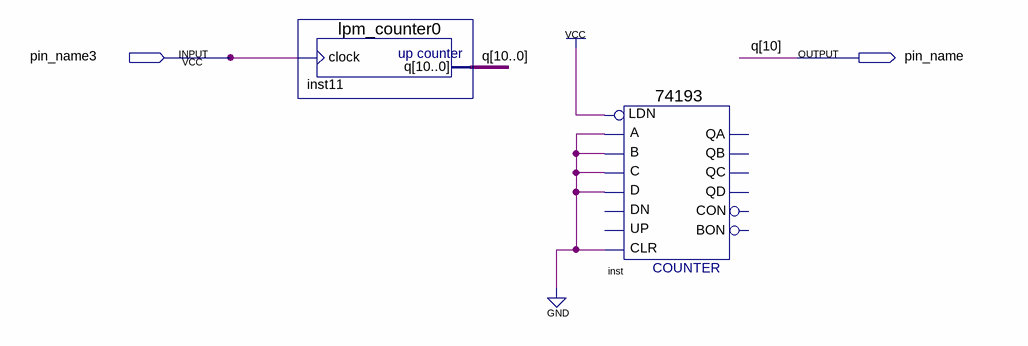
[diagram p0: schematic sheet]
// Quartus schematic lab2_1.bdf as structural Verilog: 2 symbols, 2 pins
module lab2_1 (
  input  pin_name3,
  output pin_name
);

  wire [9:0] q;

  lpm_counter0 inst11 (.clock(pin_name3), .q({pin_name, q}));
  \74193  inst (
    .D(1'b0), .C(1'b0), .B(1'b0), .A(1'b0), .CLR(1'b0), .LDN(1'b1));  // open: UP, DN, QB, QA, CON, QD, QC, BON

  // Other names for the same wires on the sheet: q[10] = pin_name
endmodule
